# EAGLE schematic schematic (EAGLE 9.6.2)
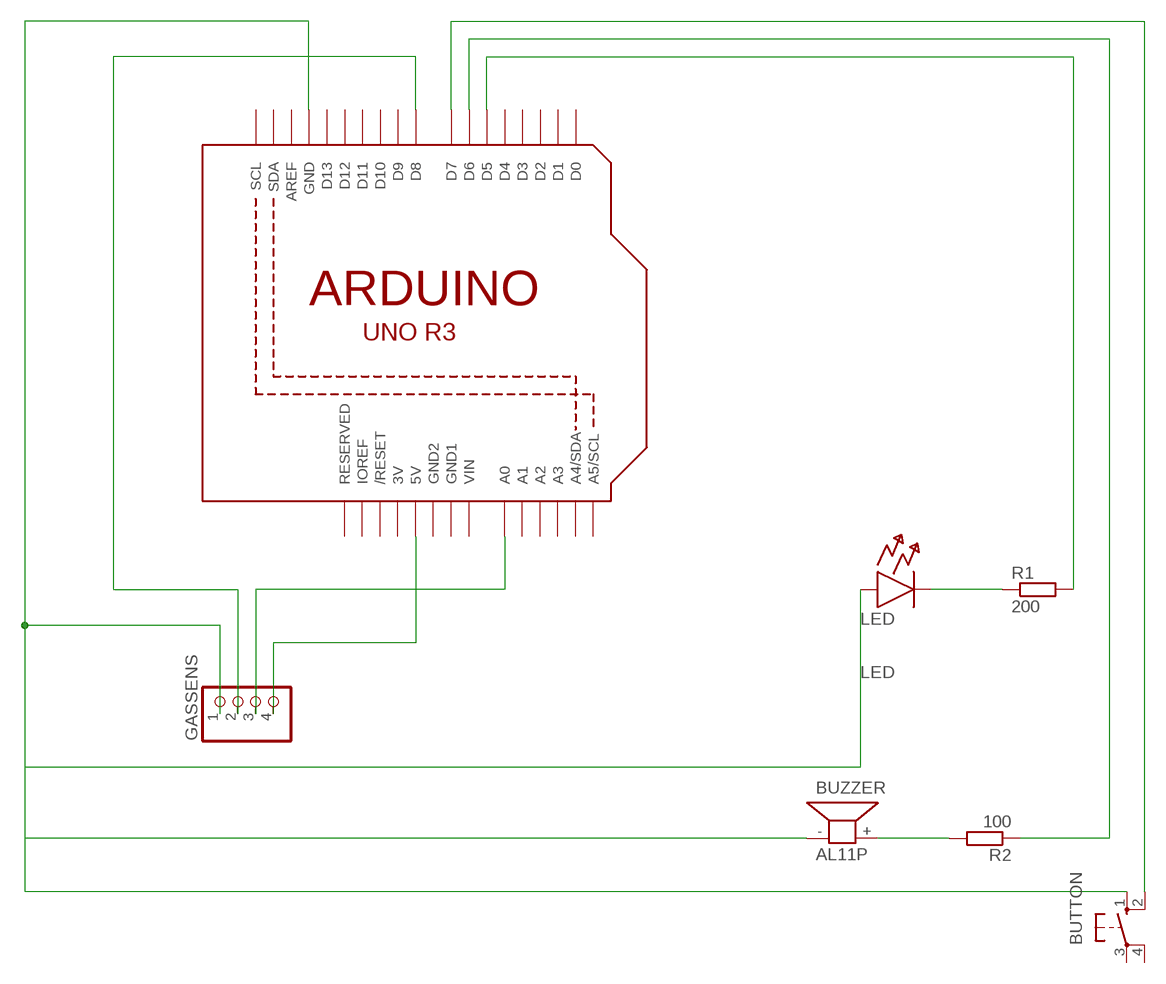
[diagram p0: schematic, sheet 1]

## Parts
BUTTON  10-XX  [B3F-10XX]
BUZZER  AL11P  [AL11P]
GASSENS  PINHD-1X4  [1X04]
LED  LED  (no package)
R1  200  R-EU_0207/7  [0207/7]
R2  100  R-EU_0207/7  [0207/7]
U1  ARDUINOR3-DIMENSION  [ARDUINOR3]

## Nets
N$1: GASSENS.4 U1.5V
N$2: GASSENS.3 U1.A0
N$3: GASSENS.2 U1.D8
N$4: R1.2 U1.D5
N$5: LED.C R1.1
N$6: BUTTON.2(S1) U1.D7
N$7: R2.1 U1.D6
N$8: BUZZER.+ R2.2
N$10: BUTTON.1(S) BUZZER.- GASSENS.1 LED.A U1.GND
Unconnected: BUTTON.3(P) BUTTON.4(P1) U1.A1 U1.A2 U1.A3 U1.A4(A4/SDA) U1.A5(A5/SCL) U1.AREF U1.D0 U1.D1 U1.D2 U1.D3 U1.D4 U1.D9 U1.D10 U1.D11 U1.D12 U1.D13 U1.IOREF U1.RESERVED U1.RESET(/RESET) U1.SCL U1.SDA

## Power pins joined to a net without a drawn wire
3V: U1.3V
GND1: U1.GND1
GND2: U1.GND2
VIN: U1.VIN

## Library data of the parts
BUTTON = switch-omron:10-XX: OMRON SWITCH
BUZZER = buzzer:AL11P: SPEAKER Source: Buerklin
GASSENS = pinhead:PINHD-1X4: PIN HEADER
LED = ngspice-simulation:LED: Diode
R1 R2 = resistor:R-EU_: RESISTOR, European symbol
U1 = adafruit:ARDUINOR3: This is a new object for the new Arduino R3 - with extra pins that you may want to use (such as IOref, and duplicated A4/A5